# EAGLE design carret (EAGLE 5.06)
A: a
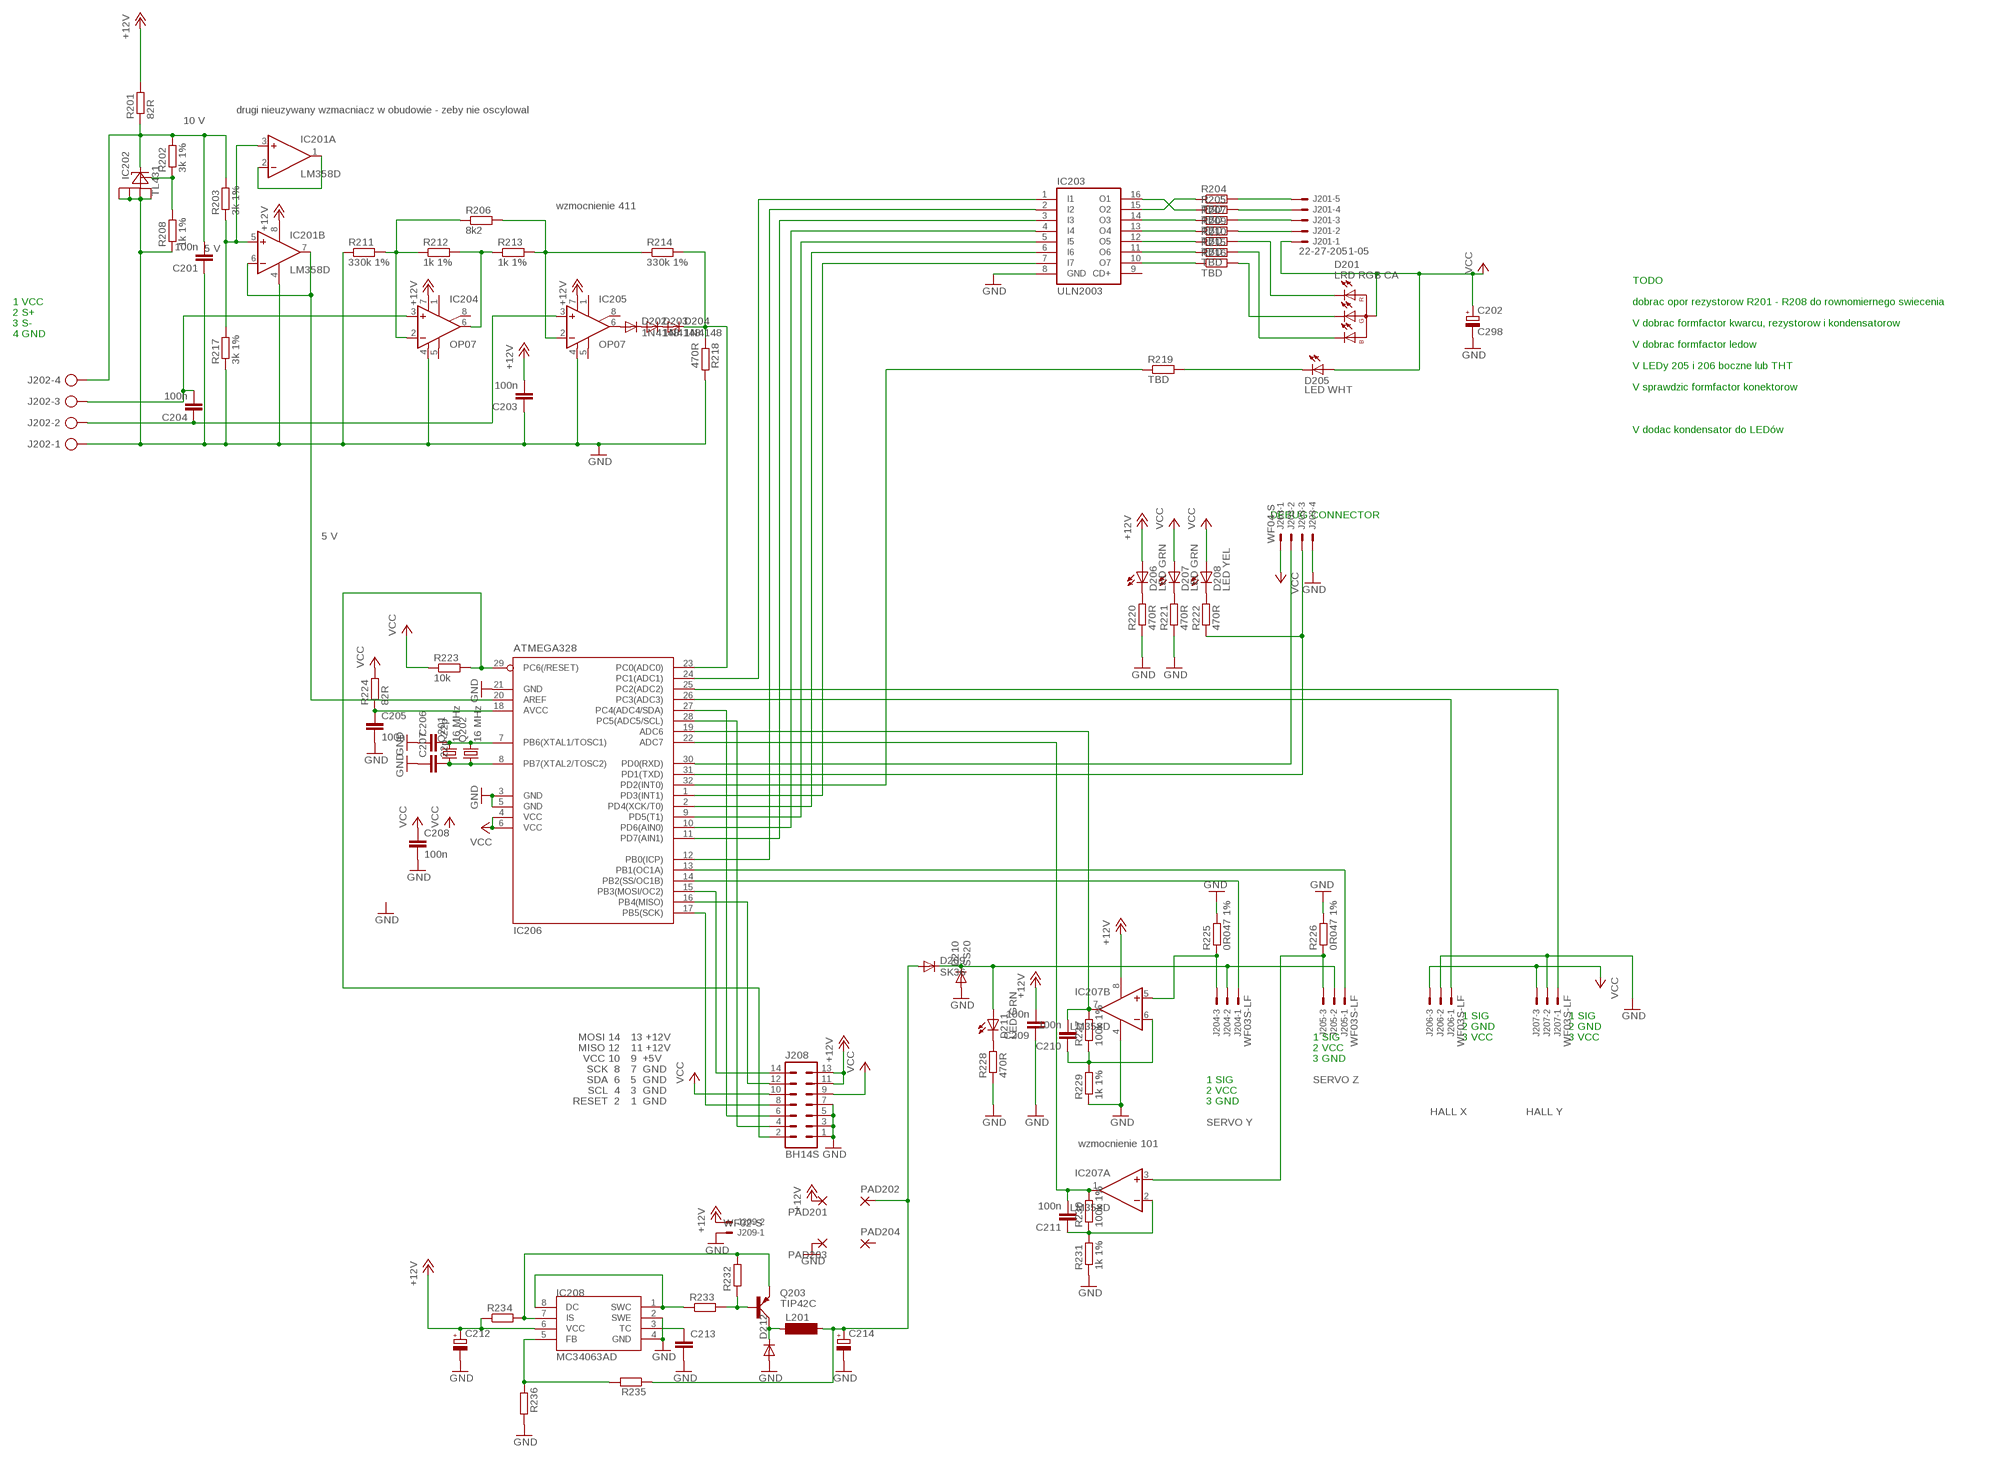
[diagram p0: schematic, sheet 1]

## Parts
C201  100n  CAP  [0805]
C202  C298  CPOL-EUE3.5-8  [E3,5-8]
C203  100n  CAP  [0805]
C204  100n  CAP  [0805]
C205  100n  CAP  [0805]
C206  22p  CAP  [0805]
C207  22p  CAP  [0805]
C208  100n  CAP  [0805]
C209  100n  CAP  [0805]
C210  100n  CAP  [0805]
C211  100n  CAP  [0805]
C212  CPOL-EUE3.5-8  [E3,5-8]
C213  CAP  [0805]
C214  CPOL-EUE3.5-8  [E3,5-8]
D201  LRD RGB CA  LED-RGB-CA  [LED-5-RGB]
D202  1N4148  DIODE-SOD80C  [SOD80C]
D203  1N4148  DIODE-SOD80C  [SOD80C]
D204  1N4148  DIODE-SOD80C  [SOD80C]
D205  LED WHT  LED5MM  [LED5MM]
D206  LED GRN  LED  [0805_DIODE]
D207  LED GRN  LED  [0805_DIODE]
D208  LED YEL  LED  [0805_DIODE]
D209  SK36  DIODE-SMC  [SMC]
D210  SS20  DIODE-DO214AA  [DO214AA]
D211  LED GRN  LED  [0805_DIODE]
D212  DIODE-SMB  [SMB]
IC201  LM358D  [SO08]
IC202  TL431  [SO08]
IC203  ULN2003  ULN2003AD  [SO16]
IC204  OP07  OP07CR  [SO08]
IC205  OP07  OP07CR  [SO08]
IC206  ATMEGA328  MEGA8-AI  [TQFP32-08]
IC207  LM358D  [SO08]
IC208  MC34063AD  [SOIC8]
J201  22-27-2051-05  [6410-05]
J202  AK300/4  [AK300/4]
J203  WF04-S  22-27-2041-04  [6410-04]
J204  WF03S-LF  22-27-2031-03  [6410-03]
J205  WF03S-LF  22-27-2031-03  [6410-03]
J206  WF03S-LF  22-27-2031-03  [6410-03]
J207  WF03S-LF  22-27-2031-03  [6410-03]
J208  BH14S  ML14  [ML14]
J209  WF02-S  22-27-2021-02  [6410-02]
L201  BS75  [BS75]
PAD201  3,81/1,1  [3,81/1,1]
PAD202  3,81/1,1  [3,81/1,1]
PAD203  3,81/1,1  [3,81/1,1]
PAD204  3,81/1,1  [3,81/1,1]
Q201  16 MHz  CRYSTALHC49UP  [HC49UP]
Q202  16 MHz  CRYSTALHC49U-V  [HC49U-V]
Q203  TIP42C  [TO220AV]
R201  82R  RES0805  [0805]
R202  3k 1%  RES0805  [0805]
R203  3k 1%  RES0805  [0805]
R204  TBD  RES0805  [0805]
R205  TBD  RES0805  [0805]
R206  8k2  RES0805  [0805]
R207  TBD  RES0805  [0805]
R208  1k 1%  RES0805  [0805]
R209  TBD  RES0805  [0805]
R210  TBD  RES0805  [0805]
R211  330k 1%  RES0805  [0805]
R212  1k 1%  RES0805  [0805]
R213  1k 1%  RES0805  [0805]
R214  330k 1%  RES0805  [0805]
R215  TBD  RES0805  [0805]
R216  TBD  RES0805  [0805]
R217  3k 1%  RES0805  [0805]
R218  470R  RES0805  [0805]
R219  TBD  RES0805  [0805]
R220  470R  RES0805  [0805]
R221  470R  RES0805  [0805]
R222  470R  RES0805  [0805]
R223  10k  RES0805  [0805]
R224  82R  RES0805  [0805]
R225  0R047 1%  R-EU_R1206  [R1206]
R226  0R047 1%  R-EU_R1206  [R1206]
R227  100k 1%  RES0805  [0805]
R228  470R  RES0805  [0805]
R229  1k 1%  RES0805  [0805]
R230  100k 1%  RES0805  [0805]
R231  1k 1%  RES0805  [0805]
R232  RES0805  [0805]
R233  RES0805  [0805]
R234  RES0805  [0805]
R235  RES0805  [0805]
R236  RES0805  [0805]

## Nets
+6V: C214.+ D209.A L201.2 PAD202.1(P) R235.1
+10V: C201.2 IC202.1(K) J202.4 R201.1 R202.2 R203.2
+12V: C203.2 C209.2 C212.+ D206.2(A) IC201.8(P:V+) IC204.7(V+) IC205.7(V+) IC207.8(P:V+) IC208.6(VCC) J208.11 J208.13 J209.2 PAD201.1(P) R201.2 R234.1
GND: C201.1 C202.- C203.1 C205.2 C206.1 C207.1 C208.2 C209.1 C212.- C213.2 C214.- D210.A D212.A IC201.4(P:V-) IC202.2(A) IC202.3(A1) IC202.6(A2) IC202.7(A3) IC203.8(GND) IC204.4(V-) IC205.4(V-) IC206.3(GND) IC206.5(GND) IC206.21(GND) IC207.4(P:V-) IC208.2(SWE) IC208.4(GND) J202.1 J203.4 J206.2 J207.2 J208.1 J208.3 J208.5 J208.7 J209.1 PAD203.1(P) R208.1 R211.1 R217.1 R218.2 R220.1 R221.1 R225.2 R226.2 R228.1 R229.1 R231.1 R236.2
MISO: IC206.16(PB4(MISO)) J208.12
MOSI: IC206.15(PB3(MOSI/OC2)) J208.14
N$1: J201.5 R204.2
N$2: J201.4 R205.2
N$3: IC203.16(O1) R205.1
N$4: IC203.15(O2) R204.1
N$5: IC203.14(O3) R207.1
N$6: IC203.10(O7) R216.1
N$7: D201.1(RC) R210.2
N$8: D201.3(BC) R215.2
N$9: D201.4(GC) R216.2
N$11: D209.C D210.C D211.2(A) J204.2 J205.2
N$12: IC203.4(I4) IC206.10(PD6(AIN0))
N$13: IC203.1(I1) IC206.24(PC1(ADC1))
N$14: IC203.2(I2) IC206.12(PB0(ICP))
N$15: IC203.13(O4) R209.1
N$16: IC203.12(O5) R210.1
N$17: IC203.11(O6) R215.1
N$18: IC203.3(I3) IC206.11(PD7(AIN1))
N$19: IC203.5(I5) IC206.9(PD5(T1))
N$20: IC203.6(I6) IC206.2(PD4(XCK/T0))
N$21: IC206.32(PD2(INT0)) R219.1
N$22: IC203.7(I7) IC206.1(PD3(INT1))
N$23: D205.K(C) R219.2
N$24: IC206.14(PB2(SS/OC1B)) J204.1
N$25: IC206.13(PB1(OC1A)) J205.1
N$26: IC206.25(PC2(ADC2)) J207.1
N$27: C207.2 IC206.8(PB7(XTAL2/TOSC2)) Q201.1 Q202.1
N$28: IC206.26(PC3(ADC3)) J206.1
N$29: IC207.5(B:+IN) J204.3 R225.1
N$30: IC207.3(A:+IN) J205.3 R226.1
N$31: C211.2 IC206.22(ADC7) IC207.1(A:OUT) R230.2
N$32: J201.3 R207.2
N$33: J201.2 R209.2
N$36: D206.1(C) R220.2
N$37: C210.2 IC206.19(ADC6) IC207.7(B:OUT) R227.2
N$38: IC206.30(PD0(RXD)) J203.2
N$39: IC206.31(PD1(TXD)) J203.3 R222.1
N$40: D208.1(C) R222.2
N$41: D204.C IC206.23(PC0(ADC0)) R214.2 R218.1
N$43: IC202.8(REF) R202.1 R208.2
N$46: C206.2 IC206.7(PB6(XTAL1/TOSC1)) Q201.2 Q202.2
N$47: D211.1(C) R228.2
N$48: C210.1 IC207.6(B:-IN) R227.1 R229.2
N$49: C204.2 IC204.3(+IN) J202.3
N$50: C204.1 IC205.3(+IN) J202.2
N$51: IC204.2(-IN) R206.1 R211.2 R212.1
N$52: IC204.6(OUT) R212.2 R213.1
N$53: IC205.2(-IN) R206.2 R213.2 R214.1
N$54: D202.A IC205.6(OUT)
N$55: D202.C D203.A
N$56: D203.C D204.A
N$57: C205.1 IC206.18(AVCC) R224.1
N$58: IC201.3(A:+IN) IC201.5(B:+IN) R203.1 R217.2
N$59: IC201.6(B:-IN) IC201.7(B:OUT) IC206.20(AREF)
N$60: IC201.1(A:OUT) IC201.2(A:-IN)
N$61: C211.1 IC207.2(A:-IN) R230.1 R231.2
N$63: D207.1(C) R221.2
N$64: IC208.7(IS) Q203.E R232.2 R234.2
N$65: IC208.1(SWC) IC208.8(DC) R233.1
N$66: Q203.B R232.1 R233.2
N$67: C213.1 IC208.3(TC)
N$68: IC208.5(FB) R235.2 R236.1
N$71: D212.C L201.1 Q203.C
RESET: IC206.29(PC6(/RESET)) J208.2 R223.2
SCK: IC206.17(PB5(SCK)) J208.8
SCL: IC206.28(PC5(ADC5/SCL)) J208.4
SDA: IC206.27(PC4(ADC4/SDA)) J208.6
VCC: C202.+ C208.1 D201.2(A) D205.A D207.2(A) D208.2(A) IC206.4(VCC) IC206.6(VCC) J201.1 J203.1 J206.3 J207.3 J208.9 J208.10 R223.1 R224.2
Unconnected: IC203.9(CD+) IC204.1(ON1) IC204.5(OPT) IC204.8(ON2) IC205.1(ON1) IC205.5(OPT) IC205.8(ON2) PAD204.1(P)

## Notes on the sheet
- drugi nieuzywany wzmacniacz w obudowie - zeby nie oscylowal
- 10 V
- wzmocnienie 411
- 5 V
- TODO
- 1 VCC | dobrac opor rezystorow R201 - R208 do rownomiernego swiecenia
- 2 S+
- 3 S- | V dobrac formfactor kwarcu, rezystorow i kondensatorow
- 4 GND
- V dobrac formfactor ledow
- V LEDy 205 i 206 boczne lub THT
- V sprawdzic formfactor konektorow
- V dodac kondensator do LEDów
- DEBUG CONNECTOR
- 5 V
- 1 SIG | 1 SIG
- 2 GND | 2 GND
- MOSI 14 | 13 +12V | 1 SIG | 3 VCC | 3 VCC
- MISO 12 | 11 +12V | 2 VCC
- VCC 10 | 9  +5V | 3 GND
- SCK  8 | 7  GND
- SDA  6 | 5  GND | 1 SIG | SERVO Z
- SCL  4 | 3  GND | 2 VCC
- RESET  2 | 1  GND | 3 GND
- HALL X | HALL Y
- SERVO Y
- wzmocnienie 101

## Library data of the parts
C201 C203-C211 C213 = barobot:CAP
C202 C212 C214 = rcl:CPOL-EU: POLARIZED CAPACITOR, European symbol
D201 = 0alib2:LED-RGB-CA: RGB LED 3 colors (red/green/blue), 5 mm, round, common Anode
D202-D204 D209 D210 D212 = diode:DIODE-: DIODE
D205 = led:LED: LED
D206-D208 D211 = barobot:LED: LED
IC201 IC207 = linear:LM358: OP AMP also LM158; LM258; LM2904 Source: http://cache.national.com/ds/LM/LM158.pdf
IC202 = 0alib:TL431
IC203 = uln-udn:ULN2003A: DRIVER ARRAY
IC204 IC205 = linear:OP07*: OP AMP
IC206 = atmel:MEGA8: MICROCONTROLLER 8 Kbytes FLASH, 1 kbytes SRAM, 512 bytes EEPROM, USART, 6-channel 10 bit ADC, 2-channel 8 bit ADC Pin compatible with Atmega48, ATMega88, ATMega168 Source: avr.lbr
IC208 = mc34063:MC34063
J201 = con-molex:22-?-05: CONNECTOR wire to board 2.54 mm (.1 inch) pitch header
J202 = con-ptr500:AK300/4: CONNECTOR
J203 = con-molex:22-?-04: CONNECTOR wire to board 2.54 mm (.1 inch) pitch header
J204-J207 = con-molex:22-?-03: CONNECTOR wire to board 2.54 mm (.1 inch) pitch header
J208 = con-ml:ML14: HARTING
J209 = con-molex:22-?-02: CONNECTOR wire to board 2.54 mm (.1 inch) pitch header
L201 = inductor-neosid:BS: INDUCTOR nominal inductance, magnetically screened
PAD201-PAD204 = wirepad:3,81/1,1: THROUGH-HOLE PAD
Q201 Q202 = crystal:CRYSTAL: CRYSTAL
Q203 = transistor-power:TIP42C: PNP TRANSISTOR
R201-R224 R227-R236 = barobot:RES
R225 R226 = resistor:R-EU_: RESISTOR, European symbol

## Board
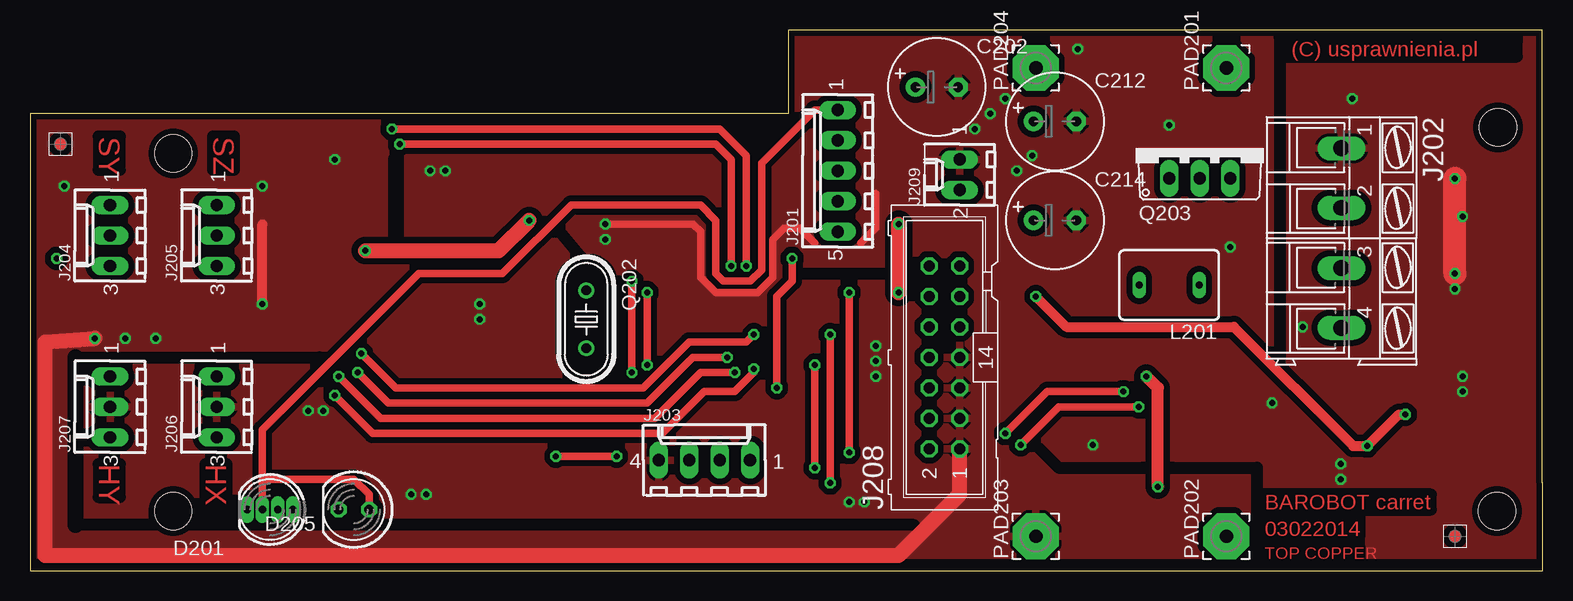
[diagram p1: board, top side]
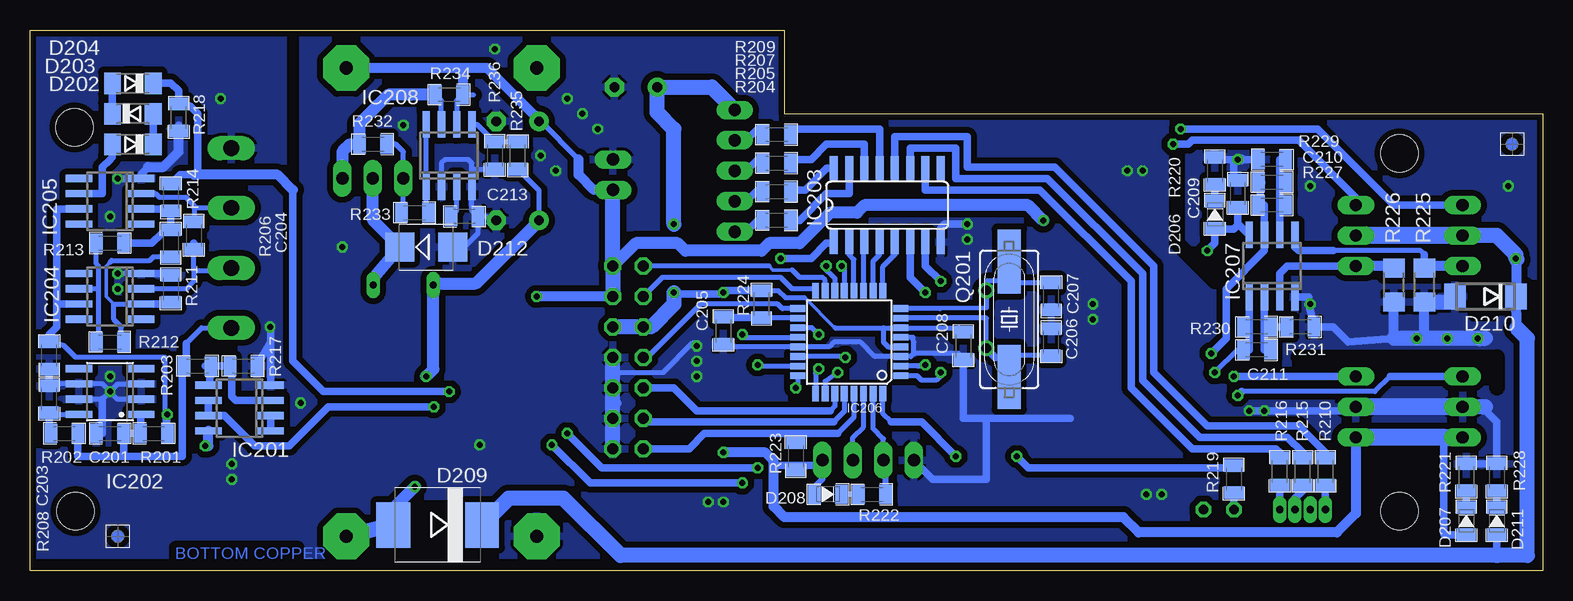
[diagram p2: board, bottom side, seen from below]

Size 126.05 x 45.09 mm. Coordinates in mm from the lower left corner, seen from the top.
Outline: 0,0 126.05,0 126.05,7.3 126.03,7.3 126.03,45.08 63.18,45.09 63.18,38.09 0,38.09 0,0
Copper layers (1*16): Top 0.035mm / dielectric 1.5mm / Bottom 0.035mm
Design rules "default *": minimum track width 10mil, minimum drill 0.5mm, track to track 10mil, track to pad 10mil, pad to pad 8mil, via to via 10mil, smd to smd 8mil, copper to edge 20mil, drill to drill 8mil, minimum pad ring 10mil, minimum via ring 8mil, stop-mask expansion 4mil, vias tented up to drill 0mil, thermal gap 10mil
Holes 3.1 mm at 122.33,36.95 122.25,4.95 11.94,4.95 11.94,34.8
tRestrict: 18 lines
bRestrict: area 4.1,21.3 to 5.7,24.1; area 90.8,2.2 to 93.3,5.4; area 116.8,34.6 to 118.1,41.6; 5 lines

### Footprints (pad centres in the part's own frame; a part is rotated, then mirrored left to right if it is on the bottom)
0805 = smd 1.044 x 1.6: 1 -1.127,0; 2 1.127,0
E3,5-8 = drill 0.813 pad 1.6 round: + -1.778,0 | drill 0.813 pad 1.6 octagon: - 1.778,0
LED-5-RGB = drill 0.6 pad 1.016 long: 1 1.905,0; 2 0.635,0; 3 -0.635,0; 4 -1.905,0
SOD80C = smd 1.4 x 1.8: A 1.7,0; C -1.7,0
LED5MM = drill 0.813 octagon: A -1.27,0; K 1.27,0
0805_DIODE = smd 1.044 x 1.6: 1 -1.127,0; 2 1.127,0
SMC = smd 2.8 x 3.8: A 3.7,0; C -3.7,0
DO214AA = smd 1.8 x 2.2: A 2.55,0; C -2.55,0
SMB = smd 2.4 x 2.4: A 2.2,0; C -2.2,0
SO08 = smd 0.6 x 2.2: 1 -1.905,-2.6; 2 -0.635,-2.6; 3 0.635,-2.6; 4 1.905,-2.6; 5 1.905,2.6; 6 0.635,2.6; 7 -0.635,2.6; 8 -1.905,2.6
SO16 = smd 0.66 x 2.032: 1 -4.445,-3.073; 2 -3.175,-3.073; 3 -1.905,-3.073; 4 -0.635,-3.073; 5 0.635,-3.073; 6 1.905,-3.073; 7 3.175,-3.073; 8 4.445,-3.073; 9 4.445,3.073; 10 3.175,3.073; 11 1.905,3.073; 12 0.635,3.073; 13 -0.635,3.073; 14 -1.905,3.073; 15 -3.175,3.073; 16 -4.445,3.073
TQFP32-08 = smd 1.27 x 0.559: 1 -4.293,2.8; 2 -4.293,2; 3 -4.293,1.2; 4 -4.293,0.4; 5 -4.293,-0.4; 6 -4.293,-1.2; 7 -4.293,-2; 8 -4.293,-2.8; 17 4.293,-2.8; 18 4.293,-2; 19 4.293,-1.2; 20 4.293,-0.4; 21 4.293,0.4; 22 4.293,1.2; 23 4.293,2; 24 4.293,2.8 | smd 0.559 x 1.27: 9 -2.8,-4.293; 10 -2,-4.293; 11 -1.2,-4.293; 12 -0.4,-4.293; 13 0.4,-4.293; 14 1.2,-4.293; 15 2,-4.293; 16 2.8,-4.293; 25 2.8,4.293; 26 2,4.293; 27 1.2,4.293; 28 0.4,4.293; 29 -0.4,4.293; 30 -1.2,4.293; 31 -2,4.293; 32 -2.8,4.293
SOIC8 = smd 0.6 x 2.2: 1 -1.905,-2.6; 2 -0.635,-2.6; 3 0.635,-2.6; 4 1.905,-2.6; 5 1.905,2.6; 6 0.635,2.6; 7 -0.635,2.6; 8 -1.905,2.6
6410-05 = drill 1.016 long: 1 5.08,0; 2 2.54,0; 3 0,0; 4 -2.54,0; 5 -5.08,0
AK300/4 = drill 1.321 long: 1 -7.493,0; 2 -2.515,0; 3 2.515,0; 4 7.493,0
6410-04 = drill 1.016 long: 1 3.81,0; 2 1.27,0; 3 -1.27,0; 4 -3.81,0
6410-03 = drill 1.016 long: 1 2.54,0; 2 0,0; 3 -2.54,0
ML14 = drill 0.914 octagon: 1 -7.62,-1.27; 2 -7.62,1.27; 3 -5.08,-1.27; 4 -5.08,1.27; 5 -2.54,-1.27; 6 -2.54,1.27; 7 0,-1.27; 8 0,1.27; 9 2.54,-1.27; 10 2.54,1.27; 11 5.08,-1.27; 12 5.08,1.27; 13 7.62,-1.27; 14 7.62,1.27
6410-02 = drill 1.016 long: 1 1.27,0; 2 -1.27,0
BS75 = drill 0.6 long: 1 -2.5,0; 2 2.5,0
3,81/1,1 = drill 1.118 pad 3.81 octagon: 1 0,0
HC49UP = smd 5.334 x 1.93: 1 -4.826,0; 2 4.826,0
HC49U-V = drill 0.813 round: 1 -2.413,0; 2 2.413,0
TO220AV = drill 1.016 long: B -2.54,-2.54; C 0,-2.54; E 2.54,-2.54
R1206 = smd 1.6 x 1.803: 1 -1.422,0; 2 1.422,0

### Placement (x,y rotation side)
C201  119.38,11.43 0 bottom
C202  75.56,40.32 0 top
C203  124.46,17.94 90 bottom
C204  112.39,27.94 270 bottom
C205  68.26,20 270 bottom
C206  40.96,19.05 270 bottom
C207  40.96,22.86 90 bottom
C208  48.26,18.73 270 bottom
C209  25.4,31.43 270 bottom
C210  22.54,32.38 180 bottom
C211  23.81,18.41 180 bottom
C212  85.41,37.47 0 top
C213  89.85,29.53 0 bottom
C214  85.41,29.21 0 top
D201  20,5.08 180 top
D202  117.47,35.56 180 bottom
D203  117.47,38.1 0 bottom
D204  117.47,40.64 180 bottom
D205  26.99,5.08 180 top
D206  27.3,29.69 270 bottom
D207  6.35,4.13 270 bottom
D208  59.53,6.35 180 bottom
D209  92.08,3.81 180 bottom
D210  4.76,22.86 180 bottom
D211  3.81,4.13 270 bottom
D212  93.03,26.99 0 bottom
IC201  108.58,13.56 90 bottom
IC202  119.38,14.92 90 bottom
IC203  54.61,30.48 0 bottom
IC204  119.38,22.86 90 bottom
IC205  119.38,30.8 90 bottom
IC206  57.78,19.05 180 bottom
IC207  22.54,25.4 0 bottom
IC208  91.12,34.61 0 bottom
J201  67.31,33.34 90 top
J202  109.28,27.73 270 top
J203  56.2,9.21 0 top
J204  6.67,27.94 90 top
J205  15.56,27.94 90 top
J206  15.56,13.65 90 top
J207  6.67,13.65 90 top
J208  76.2,17.78 90 top
J209  77.47,33.02 90 top
L201  94.93,23.81 180 top
PAD201  99.69,41.91 90 top
PAD202  99.69,2.86 90 top
PAD203  83.82,2.86 90 top
PAD204  83.82,41.91 90 top
Q201  44.45,20.95 270 bottom
Q202  46.35,20.95 270 top
Q203  97.47,35.24 0 top
R201  115.73,11.43 0 bottom
R202  123.19,11.43 0 bottom
R203  112.08,17.05 180 bottom
R204  63.82,29.21 180 bottom
R205  63.82,31.59 180 bottom
R206  114.3,27.3 90 bottom
R207  63.82,33.97 180 bottom
R208  124.46,14.29 270 bottom
R209  63.82,36.35 180 bottom
R210  18.1,8.26 270 bottom
R211  114.3,23.5 270 bottom
R212  119.38,19.05 180 bottom
R213  119.38,27.3 0 bottom
R214  114.3,31.11 90 bottom
R215  20,8.26 270 bottom
R216  21.91,8.26 270 bottom
R217  108.27,17.05 180 bottom
R218  113.67,37.78 270 bottom
R219  25.72,7.62 270 bottom
R220  27.3,33.34 270 bottom
R221  6.35,7.78 270 bottom
R222  55.88,6.35 180 bottom
R223  62.23,9.53 90 bottom
R224  65.09,22.23 90 bottom
R225  9.84,23.81 270 bottom
R226  12.38,23.81 270 bottom
R227  22.54,30.48 180 bottom
R228  3.81,7.78 270 bottom
R229  22.54,34.29 0 bottom
R230  23.81,20.32 180 bottom
R231  20.16,20.32 180 bottom
R232  97.47,35.56 180 bottom
R233  93.98,29.84 180 bottom
R234  91.12,39.69 180 bottom
R235  85.41,34.61 90 bottom
R236  87.31,34.61 270 bottom
U$1  [FIDUCIAL_G10S]  2.54,35.56 0 top
U$2  [FIDUCIAL_G10S]  118.75,2.86 0 top
U$3  [FIDUCIAL_G10S]  118.75,2.86 0 bottom
U$4  [FIDUCIAL_G10S]  2.54,35.56 0 bottom

### Tracks (layer width: path | path; a pad name or v marks a point on that pad's centre or on a via)
+6V  (via drill 0.5)
  Top 1.016: v93.03,16.19 93.98,15.24 v93.98,6.99
  Bottom 0.406: L201.2 91.92,23.94 | R235.1 83.63,31.7 C214.+
  Bottom 1.016: 91.92,23.94 88.9,23.94 C214.+ | L201.2 92.43,16.79 v93.03,16.19 | v93.98,6.99 95.78,5.19 D209.A
  Bottom 1.27: D209.A PAD202.1
+10V
  Bottom 0.406: IC202.1 116.84,13.02 | 113.03,18.95 111.74,20.24 J202.4
  Bottom 0.61: R202.2 122.08,9.53 118.22,9.53 | 118.22,9.53 C201.2 R201.1 116.84,13.02 IC202.1 | 118.22,9.53 113.35,9.53 113.35,16.73 R203.2 113.03,17.05 113.03,18.95
+12V  (via drill 0.5)
  Top 0.813: v114.62,13.02 114.08,13.02 v111.44,10.38 110.27,10.38 100.33,20.32 86.36,20.32 v83.82,22.86
  Top 1.27: v41.59,29.21 39.05,26.67 v27.94,26.67
  Bottom 0.406: 114.78,12.06 114.78,17.78 114.94,17.78 122.24,17.78 123.24,18.78 C203.2 | IC208.6 90.49,39.2 R234.1 89.09,39.69 | 80.33,34.29 83.5,37.47
  Bottom 0.508: R201.2 114.6,11.89 114.78,12.06 114.62,12.22 v114.62,13.02
  Bottom 0.61: IC205.7 123.83,30.16 123.83,22.23 | 123.83,22.23 123.83,20.32 124.46,19.68 C203.2 | 123.83,22.23 IC204.7 | 25.4,29.21 25.4,28.95 IC207.8 | 25.4,29.21 C209.2 | 25.4,29.21 25.4,28.8 25.72,28.48 27.22,28.48 D206.2 27.3,27.3 v27.94,26.67
  Bottom 0.813: v111.44,10.38 111.19,10.38 IC201.8 | J208.11 v83.82,22.86 | 90.17,41.91 87.95,41.91 83.98,37.94 | 90.17,41.91 PAD201.1 | 83.5,37.47 83.98,37.94 | 80.33,34.29 80.33,33.02 79.06,31.75 J209.2 | R234.1 90,41.74 90.17,41.91 | C212.+ 83.63,37.59 83.98,37.94
  Bottom 1.016: v41.59,29.21 42.86,30.48 56.52,30.48 57.15,29.84 59.37,29.84 61.91,27.3 64.45,27.3 65.09,26.67 71.44,26.67 72.07,27.3 75.56,27.3 J208.13
  Bottom 1.27: J208.11 J208.13 J209.2
GND  (via drill 0.5)
  Top 0.61: 65.41,27.3 64.14,28.57 62.87,28.57 61.91,27.62 61.91,24.45 60.64,23.18 57.15,23.18 55.88,24.45 55.88,28.26 55.24,28.89 v47.94,28.89 | 69.22,27.3 70.48,28.57 70.48,31.43
  Top 0.813: v19.37,22.23 19.37,28.89
  Top 1.27: v5.4,19.37 1.27,19.05 1.27,1.27 72.39,1.27 77.47,6.35 J208.1
  Top 1.93: v118.75,24.77 v118.75,32.7
  Bottom 0.406: 68.26,18.65 IC206.21 59.45,18.65 59.05,19.05 56.83,19.05 55.63,17.85 IC206.3 52.63,17.85 52.39,18.1 | 68.26,18.65 68.58,18.65 | 52.39,18.1 52.39,19.05 52.47,19.45 IC206.5 | 48.62,18.1 52.39,18.1 | 70.8,19 73.3,16.51 77.47,16.51 | R208.1 124.14,15.56 IC202.6 120.02,15.56 v119.38,14.92 | IC202.7 120.02,14.29 v119.38,14.92 | IC202.2 118.75,14.29 v119.38,14.92 | IC202.3 118.75,15.56 119.22,15.08 | IC204.4 v118.75,24.77 | 68.26,18.65 C205.2 | 89.22,33.66 89.22,33.97 89.53,34.29 91.44,34.29 91.76,33.97 IC208.2 | 89.22,33.66 IC208.4 89.22,30.02 C213.2 | R236.2 89.04,33.48 89.22,33.66 | C213.2 88.08,29.53 C214.- | D212.A 89.85,26.99 88.72,28.11 C213.2
  Bottom 0.61: 48.26,12.7 C208.2 | 5.08,13.65 3.81,12.38 R228.1 R221.1 | 12.38,19.37 16.19,19.05 17.46,20.32 R231.1 19.47,22.23 19.47,22.8 IC207.4 | v47.94,28.89 49.85,28.89 50.16,28.57 IC203.8 | 25.72,34.29 25.08,34.29 | v25.4,34.29 R229.1 | 25.72,34.29 25.72,33.02 C209.1 | 25.72,34.29 27.2,34.29 | IC204.4 114.3,24.77 R211.1 | 113.67,36.83 R218.2 113.67,37.15 | 105.73,15.46 IC201.4 105.98,19.05 | C201.1 120.02,11.43 120.02,14.29 | v118.75,32.7 IC205.4 | IC205.4 116.2,32.7 | R208.1 C203.1 | v119.38,14.92 119.22,15.08 | 105.98,19.05 R217.1 | 105.98,19.05 105.98,20.26 v106.05,20.32 | 39.37,12.7 48.26,12.7 | 48.26,12.7 46.35,12.7 46.35,7.62 50.8,7.62 J203.4 | v24.45,13.34 15.88,13.34 J206.2 | 116.2,33.66 116.78,33.08 IC205.4
  Bottom 0.813: 12.38,19.37 R226.2 | 9.84,19.37 R225.2 | 77.47,13.97 77.15,13.97 | 25.08,34.29 v25.4,34.29 | 19.47,22.23 v19.37,22.23 | R218.2 113.67,34.92 114.94,33.66 116.2,33.66
  Bottom 1.27: 4.76,13.65 5.08,13.65 J207.2 | 4.76,19.37 v5.4,19.37 9.84,19.37 12.38,19.37 | D210.A 7.86,22.39 R225.2 | J208.1 J208.3 77.47,13.97 J208.5 77.47,16.51 J208.7
  Bottom 1.422: J207.2 J206.2
  other vias: 7.94,19.37 10.48,19.37 19.37,32.07 109.22,8.89 110.17,39.37 23.18,13.34 31.75,6.35 33.02,6.35 109.22,7.62 119.38,29.53 118.75,23.5 119.38,16.19 81.28,39.37 70.48,18.73 70.48,17.46 70.48,16.19 33.34,33.34 34.61,33.34 2.86,32.07 68.26,5.71 69.53,5.71 83.5,34.61 82.23,33.34 80.01,38.1 78.74,36.83 37.47,22.23 37.47,20.95 47.94,27.62 103.5,13.97 88.58,10.48 100.01,26.99 94.93,37.15 87.31,43.5
  pour Top (isolate 0.508, rank 3): 0,38.1 63.5,38.1 63.5,44.45 125.73,44.45 125.73,1.27 0,1.27
  pour Bottom (isolate 0.508): 0,38.1 63.5,38.1 63.5,44.45 125.73,44.45 125.73,1.27 0,1.27
MISO
  Bottom 0.406: J208.12 73.34,24.45 63.5,24.45 62.55,23.5 60.74,23.5 IC206.16
MOSI
  Bottom 0.305: 62.55,25.08 64.14,25.08 64.45,25.4
  Bottom 0.406: 74.61,25.4 J208.14 64.45,25.4 | IC206.15 59.78,24.23 60.01,24.45 61.91,24.45 62.55,25.08
N$1
  Bottom 0.61: R204.2 65.41,29.21 66.36,28.26 J201.5
N$2
  Bottom 0.61: R205.2 65.41,31.75 66.36,30.8 J201.4
N$3
  Bottom 0.61: R205.1 62.23,31.75 61.44,31.75 59.63,33.55 IC203.16
N$4
  Bottom 0.61: IC203.15 57.78,31.43 59.69,31.43 61.91,29.21 R204.1 62.55,29.21
N$5
  Bottom 0.61: R207.1 62.23,34.29 60.96,34.29 59.69,35.56 56.52,35.56 IC203.14
N$6
  Bottom 0.61: IC203.10 51.44,31.75 41.91,31.75 34.29,24.13 34.29,15.24 29.21,10.16 22.23,10.16 21.91,9.84 R216.1
N$7
  Bottom 0.61: D201.1 R210.2
N$8
  Bottom 0.61: D201.3 20.64,6.03 20,6.67 R215.2
N$9
  Bottom 0.61: D201.4 R216.2
N$11  (via drill 0.5)
  Bottom 0.61: 3.81,1.27 D211.2
  Bottom 0.813: 2.14,20.23 D210.C | 2.14,23.18 2.14,25.95
  Bottom 1.27: J204.2 3.81,27.94 2.22,26.35 v2.22,26.04 2.14,25.95 | D210.C 2.14,23.18 | 2.14,20.23 1.27,19.37 1.27,1.27 3.81,1.27 76.83,1.27 81.6,6.03 86.15,6.03 D209.C
  Bottom 1.422: J204.2 J205.2
N$12
  Bottom 0.406: IC206.10 55.78,25.81 55.24,26.35 IC203.4
N$13  (via drill 0.5)
  Top 0.61: v63.5,26.04 63.5,24.13 62.23,22.86 v62.23,15.24
  Bottom 0.406: IC206.24 62.08,15.39 v62.23,15.24 | 59.16,27.3 IC203.1
  Bottom 0.61: 59.16,27.3 59.69,27.3 60.96,26.04 v63.5,26.04
N$14
  Bottom 0.406: IC206.12 57.38,25.95 57.78,26.35 IC203.2
N$15
  Bottom 0.61: IC203.13 55.24,36.83 62.21,36.83 R209.1
N$16
  Bottom 0.61: IC203.12 53.98,36.2 47.94,36.2 47.94,33.66 43.81,33.66 | 43.81,33.66 43.18,33.66 | 43.81,33.66 40.64,33.66 32.38,25.4 32.38,16.51 27.94,12.06 20.32,12.06 18.1,9.84 R210.1
N$17
  Bottom 0.61: IC203.11 52.7,35.24 48.9,35.24 48.9,32.7 41.27,32.7 33.34,24.77 33.34,15.88 28.57,11.11 21.27,11.11 20,9.84 R215.1
N$18
  Bottom 0.406: IC206.11 56.59,27.34 IC203.3
N$19
  Bottom 0.406: IC206.9 54.98,25.34 53.98,26.35 IC203.5
N$20  (via drill 0.5)
  Top 0.61: v51.44,17.14 v51.44,23.18
  Bottom 0.406: 52.07,17.05 IC206.2 | 52.07,17.05 51.85,17.05 | v51.44,17.14 51.44,17.05 52.07,17.05
  Bottom 0.61: v51.44,23.18 52.7,24.45 IC203.6
N$21  (via drill 0.5)
  Top 0.61: v43.81,9.53 v48.9,9.53
  Bottom 0.406: IC206.32 54.98,13.07 54.29,12.38
  Bottom 0.61: R219.1 25.82,8.57 42.86,8.57 v43.81,9.53 | 54.29,12.38 51.75,12.38 v48.9,9.53
N$22  (via drill 0.5)
  Top 0.61: v50.16,16.51 v50.16,24.13
  Bottom 0.406: v50.16,16.51 50.16,16.25 50.54,15.88 51.75,15.88 52.13,16.25 IC206.1
  Bottom 0.61: v50.16,24.13 51.44,25.4 IC203.7
N$23
  Bottom 0.61: R219.2 D205.K
N$24  (via drill 0.5)
  Top 0.61: v30.16,36.83 57.47,36.83 59.69,34.61 v59.69,25.4
  Bottom 0.406: IC206.14 58.98,24.38 60.01,25.4 v59.69,25.4
  Bottom 0.61: v30.16,36.83 18.73,36.83 12.38,30.48 J204.1
N$25  (via drill 0.5)
  Top 0.61: v58.42,25.4 58.42,34.29 57.15,35.56 v30.8,35.56
  Bottom 0.406: IC206.13 58.19,25.16 v58.42,25.4
  Bottom 0.61: v30.8,35.56 29.53,35.56 29.21,35.88 20.32,35.88 15.56,31.11 J205.1
N$26  (via drill 0.5)
  Top 0.61: v25.4,14.61 28.57,11.43 52.7,11.43 56.2,14.92 58.74,14.92 60.33,16.51 v60.33,16.83
  Bottom 0.406: IC206.25 60.59,16.45 v60.33,16.83 | 12.7,16.19 13.97,14.92 25.08,14.92
  Bottom 0.61: J207.1 12.7,16.19 | 25.08,14.92 v25.4,14.61
N$27
  Bottom 0.406: IC206.8 50.22,21.85 46.35,21.91 Q202.1 46.35,24.13 44.45,24.13 44.31,23.99 C207.2
  Bottom 0.61: 44.45,23.86 44.45,24.13 Q201.1
N$28  (via drill 0.5)
  Top 0.61: v58.74,16.51 55.88,16.51 52.07,12.7 29.21,12.7 v25.72,16.19
  Bottom 0.406: IC206.26 59.78,15.78 v58.74,16.51
  Bottom 0.61: J206.1 v25.72,16.19
N$29
  Bottom 0.406: 9.84,26.35 10.16,26.67 17.46,26.67
  Bottom 0.61: 9.21,25.4 R225.1 9.84,26.35 | 17.46,26.67 20.32,26.67 20.64,26.99 IC207.5
  Bottom 0.813: J204.3 9.21,25.4
N$30
  Bottom 0.61: R226.1 13.18,25.4 | J205.3 21.27,25.4 21.91,24.77 IC207.3
  Bottom 0.813: 13.18,25.4 J205.3
N$31  (via drill 0.5)
  Top 0.61: v58.1,17.78 55.24,17.78 51.44,13.97 29.84,13.97 v27.3,16.51
  Bottom 0.406: IC206.22 58.17,17.85 v58.1,17.78 | v27.3,16.51 25.4,18.41 C211.2
  Bottom 0.61: C211.2 24.45,18.41 24.45,20.32 | 24.45,20.32 IC207.1 | 24.45,20.32 R230.2
N$32
  Bottom 0.61: R207.2 65.41,34.29 66.36,33.34 J201.3
N$33
  Bottom 0.61: R209.2 65.41,36.83 66.36,35.88 J201.2
N$36
  Bottom 0.61: D206.1 R220.2
N$37  (via drill 0.5)
  Top 0.61: v27.62,18.1 30.48,15.24 51.12,15.24 54.93,19.05 59.69,19.05 v60.33,19.68
  Bottom 0.406: IC206.19 60.89,20.25 v60.33,19.68
  Bottom 0.61: 23.54,32.87 C210.2 23.39,32.38 R227.2 23.18,30.48 IC207.7 23.18,26.67 26.35,23.5 26.35,19.37 v27.62,18.1
N$38
  Bottom 0.406: IC206.30 56.59,11.99 57.47,11.11 J203.2
N$39
  Bottom 0.406: 54.93,10.16 J203.3 55.03,9.21 | 54.93,10.16 54.93,10.48 | IC206.31 55.78,11.84 54.93,10.98 54.93,10.16
  Bottom 0.508: R222.1 54.75,9.03 J203.3
N$40
  Bottom 0.406: R222.2 D208.1
N$41  (via drill 0.5)
  Top 0.61: v65.41,8.57 v65.41,17.14 | v81.28,11.43 84.77,14.92 v91.12,14.92
  Bottom 0.406: IC206.23 64.99,17.05 v65.41,17.14
  Bottom 0.61: 104.14,31.75 104.14,17.46 101.6,14.92 v91.12,14.92 | 112.39,33.02 113.53,33.02 R214.2 | D204.C 114.3,40.64 113.67,40.01 R218.1 112.71,38.73 112.08,38.1 112.08,33.02 | v65.41,8.57 78.42,8.57 v81.28,11.43
  Bottom 0.813: 104.14,31.75 105.41,33.02 112.08,33.02 112.39,33.02
N$43
  Bottom 0.406: R208.2 124.14,13.02 IC202.8 121.92,13.02
  Bottom 0.61: R202.1 124.46,11.43 R208.2
N$46
  Bottom 0.406: Q202.2 46.35,21.05 IC206.7 | C206.2 44.31,17.92 44.45,17.78
  Bottom 0.61: 44.45,17.78 44.45,18.05 | 44.45,17.78 Q201.2 | Q202.2 45.59,17.78 44.45,17.78
N$47
  Bottom 0.61: R228.2 D211.1
N$48
  Bottom 0.61: IC207.6 21.91,30.48 | 21.91,30.48 21.91,32.38 | 21.91,32.38 21.91,34.29 R229.2 | 21.91,32.38 C210.1 | 21.91,30.48 R227.1
N$49
  Bottom 0.406: IC204.3 113.03,23.5 112.39,24.13 112.39,25 | 112.39,26.99 C204.2 112.39,25 | J202.3 109.28,25 112.39,25
  Bottom 0.61: C204.2 112.39,27.3
N$50
  Bottom 0.406: IC205.3 115.57,31.43 115.25,31.11 113.03,31.11 112.39,30.48 112.39,30.25 112,30.25 | C204.1 112.35,29.26 112.35,30.25 112,30.25 | J202.2 112,30.25
N$51
  Bottom 0.305: 119.38,25.72 119.69,25.4 119.7,25.4 119.7,22.86 119.06,22.23
  Bottom 0.406: IC204.2 119.06,22.23 119.06,20.95 118.43,20.32 118.43,19.23 R212.1 | 119.38,25.72 119.24,25.86 116.06,25.86 115.75,26.18 R206.1
  Bottom 0.61: IC204.2 114.62,22.23 114.48,22.37 R211.2
N$52
  Bottom 0.406: 120.33,23.5 120.33,25.4 120.51,25.57 R213.1 | 120.33,23.5 120.33,19.05 R212.2 | 120.33,23.5 IC204.6
N$53
  Bottom 0.61: IC205.2 114.47,30.16 R214.1 R206.2 115.08,28.11 115.89,27.3 R213.2
N$54
  Bottom 0.61: IC205.6 120.02,31.43 120.02,33.02 120.02,33.66 119.38,34.29 119.17,34.49 D202.A 119.38,35.35
N$55
  Bottom 0.61: D202.C D203.A
N$56
  Bottom 0.61: D203.C D204.A
N$57
  Bottom 0.406: IC206.18 64.76,21.05 | 68.17,21.1 68.23,21.1 C205.1
  Bottom 0.61: 68.17,21.1 R224.1 64.81,21.1 64.76,21.05
N$58
  Bottom 0.61: 111.44,15.46 IC201.5 111.13,15.46 R203.1 | R203.1 R217.2 109.22,16.73 109.22,14.51 108.9,14.19 IC201.3 | R203.1 111.44,17.05
N$59  (via drill 0.5)
  Top 0.61: v66.67,7.3 v66.67,19.68 | v82.55,10.48 85.72,13.65 v92.39,13.65
  Bottom 0.406: IC206.20 66.44,19.45 v66.67,19.68
  Bottom 0.61: IC201.6 IC201.7 109.86,12.92 107.31,10.38 104.46,10.38 101.19,13.65 100.65,13.65 v92.39,13.65 | v66.67,7.3 79.38,7.3 v82.55,10.48
N$60
  Bottom 0.61: IC201.1 IC201.2
N$61
  Bottom 0.61: 23.18,20.32 23.18,18.41 C211.1 | 23.18,20.32 IC207.2 | 23.18,20.32 R230.1 R231.2
N$63
  Bottom 0.61: R221.2 D207.1
N$64
  Bottom 0.406: IC208.7 91.76,39.2 R234.2 | R232.2 99.38,35.56
  Bottom 1.016: 99.38,35.56 100.01,34.92 Q203.E | R234.2 94.3,39.69 96.2,39.69 97.16,38.73 98.6,37.29 R232.2
N$65
  Bottom 0.406: IC208.8 IC208.1 93.03,29.99 R233.1
N$66
  Bottom 0.406: R232.1 95.57,35.56 94.93,34.92 Q203.B 94.93,30.02 R233.2
N$67
  Bottom 0.406: IC208.3 90.49,30.02 C213.1
N$68
  Bottom 0.406: R235.2 R236.1 88.78,37.21 IC208.5
N$71
  Bottom 0.406: L201.1 97.13,24.75
  Bottom 1.016: 97.13,24.75 D212.C 97.47,29.23 Q203.C
RESET
  Bottom 0.406: IC206.29 57.38,12.78 58.74,11.43
  Bottom 0.61: 58.74,11.43 62.23,11.43 | 62.23,11.43 69.85,11.43 71.12,10.16 J208.2 | 62.23,11.43 R223.2
SCK
  Bottom 0.406: J208.8 74.61,17.78 70.17,22.23 63.72,22.23 63.35,21.85 IC206.17
SCL
  Bottom 0.406: IC206.28 58.19,13.25 59.05,12.38
  Bottom 0.61: 59.05,12.38 70.48,12.38 74.93,12.38 J208.4
SDA
  Bottom 0.406: IC206.27 58.98,13.72 59.37,13.34
  Bottom 0.61: 59.37,13.34 70.48,13.34 72.39,15.24 J208.6
VCC  (via drill 0.5)
  Top 0.61: v68.26,9.84 v68.26,23.18 | 19.37,7.62 D201.2 | 19.37,7.62 26.99,7.62 28.26,6.35 D205.A | 19.37,7.62 19.37,11.75 32.38,24.77 39.37,24.77 45.09,30.48 55.88,30.48 57.15,29.21 57.15,24.77 57.78,24.13 60.01,24.13 60.96,25.08 60.96,33.97 65.41,38.42 J201.1
  Top 1.27: v72.39,23.18 v72.39,28.89
  Bottom 0.305: 61.49,22.76 58.98,20.25
  Bottom 0.406: 54.93,20.25 IC206.6 48.65,20.25 C208.1 | 58.98,20.25 54.93,20.25 | 60.42,8.79 J203.1 | IC206.4 54.53,18.65 54.93,19.05 54.93,20.25 | 61.49,22.76 63.08,22.76 63.67,23.35 R224.2
  Bottom 0.508: D208.2 60.74,6.89 60.01,7.62 J203.1
  Bottom 0.61: 62.23,8.79 60.42,8.79 | 62.23,8.79 R223.1 | 8.26,11.11 8.26,3.08 8.18,3 D207.2 | R224.2 68.09,23.35 v68.26,23.18 68.26,23.07 72.29,23.07 v72.39,23.18 | 62.23,8.79 63.99,8.79 64.09,8.89
  Bottom 0.813: J206.3 15.56,4.76 17.14,3.17 33.66,3.17 34.92,4.45 63.18,4.45 64.09,5.35 64.09,8.89 64.09,9.16 64.77,9.84 v68.26,9.84
  Bottom 1.27: J208.9 J208.10 74.3,20.32 72.39,22.23 v72.39,23.18 | v72.39,28.89 72.39,36.83 73.79,38.23 C202.+ 69.22,40.32 J201.1
  Bottom 1.422: J207.3 8.26,11.11 J206.3

### Text on the board
Top: (C) usprawnienia.pl | SY | SZ | HY | HX | BAROBOT carret | 03022014 | TOP COPPER
Bottom: BOTTOM COPPER
HelpDim: PRZETWORNICA